# Altium schematic sheet VNA_5.SchDoc: VNA
size 409 x 289 mm; Origin: Eagle; OriginPath: C:\Users\Ground Lab\Desktop\LibreVNA\Hardware\Eagle\VNA.sch; OriginSheet: 6; OriginDescription: Port 1; Date: 04.05.2025 20:03:37; SheetNumber: 6; GateName_1: G$1; SymbolName_1: A3L-LOC; LibraryName: VNA; DeviceSetName: A3L-LOC; Sheet: Sheet:
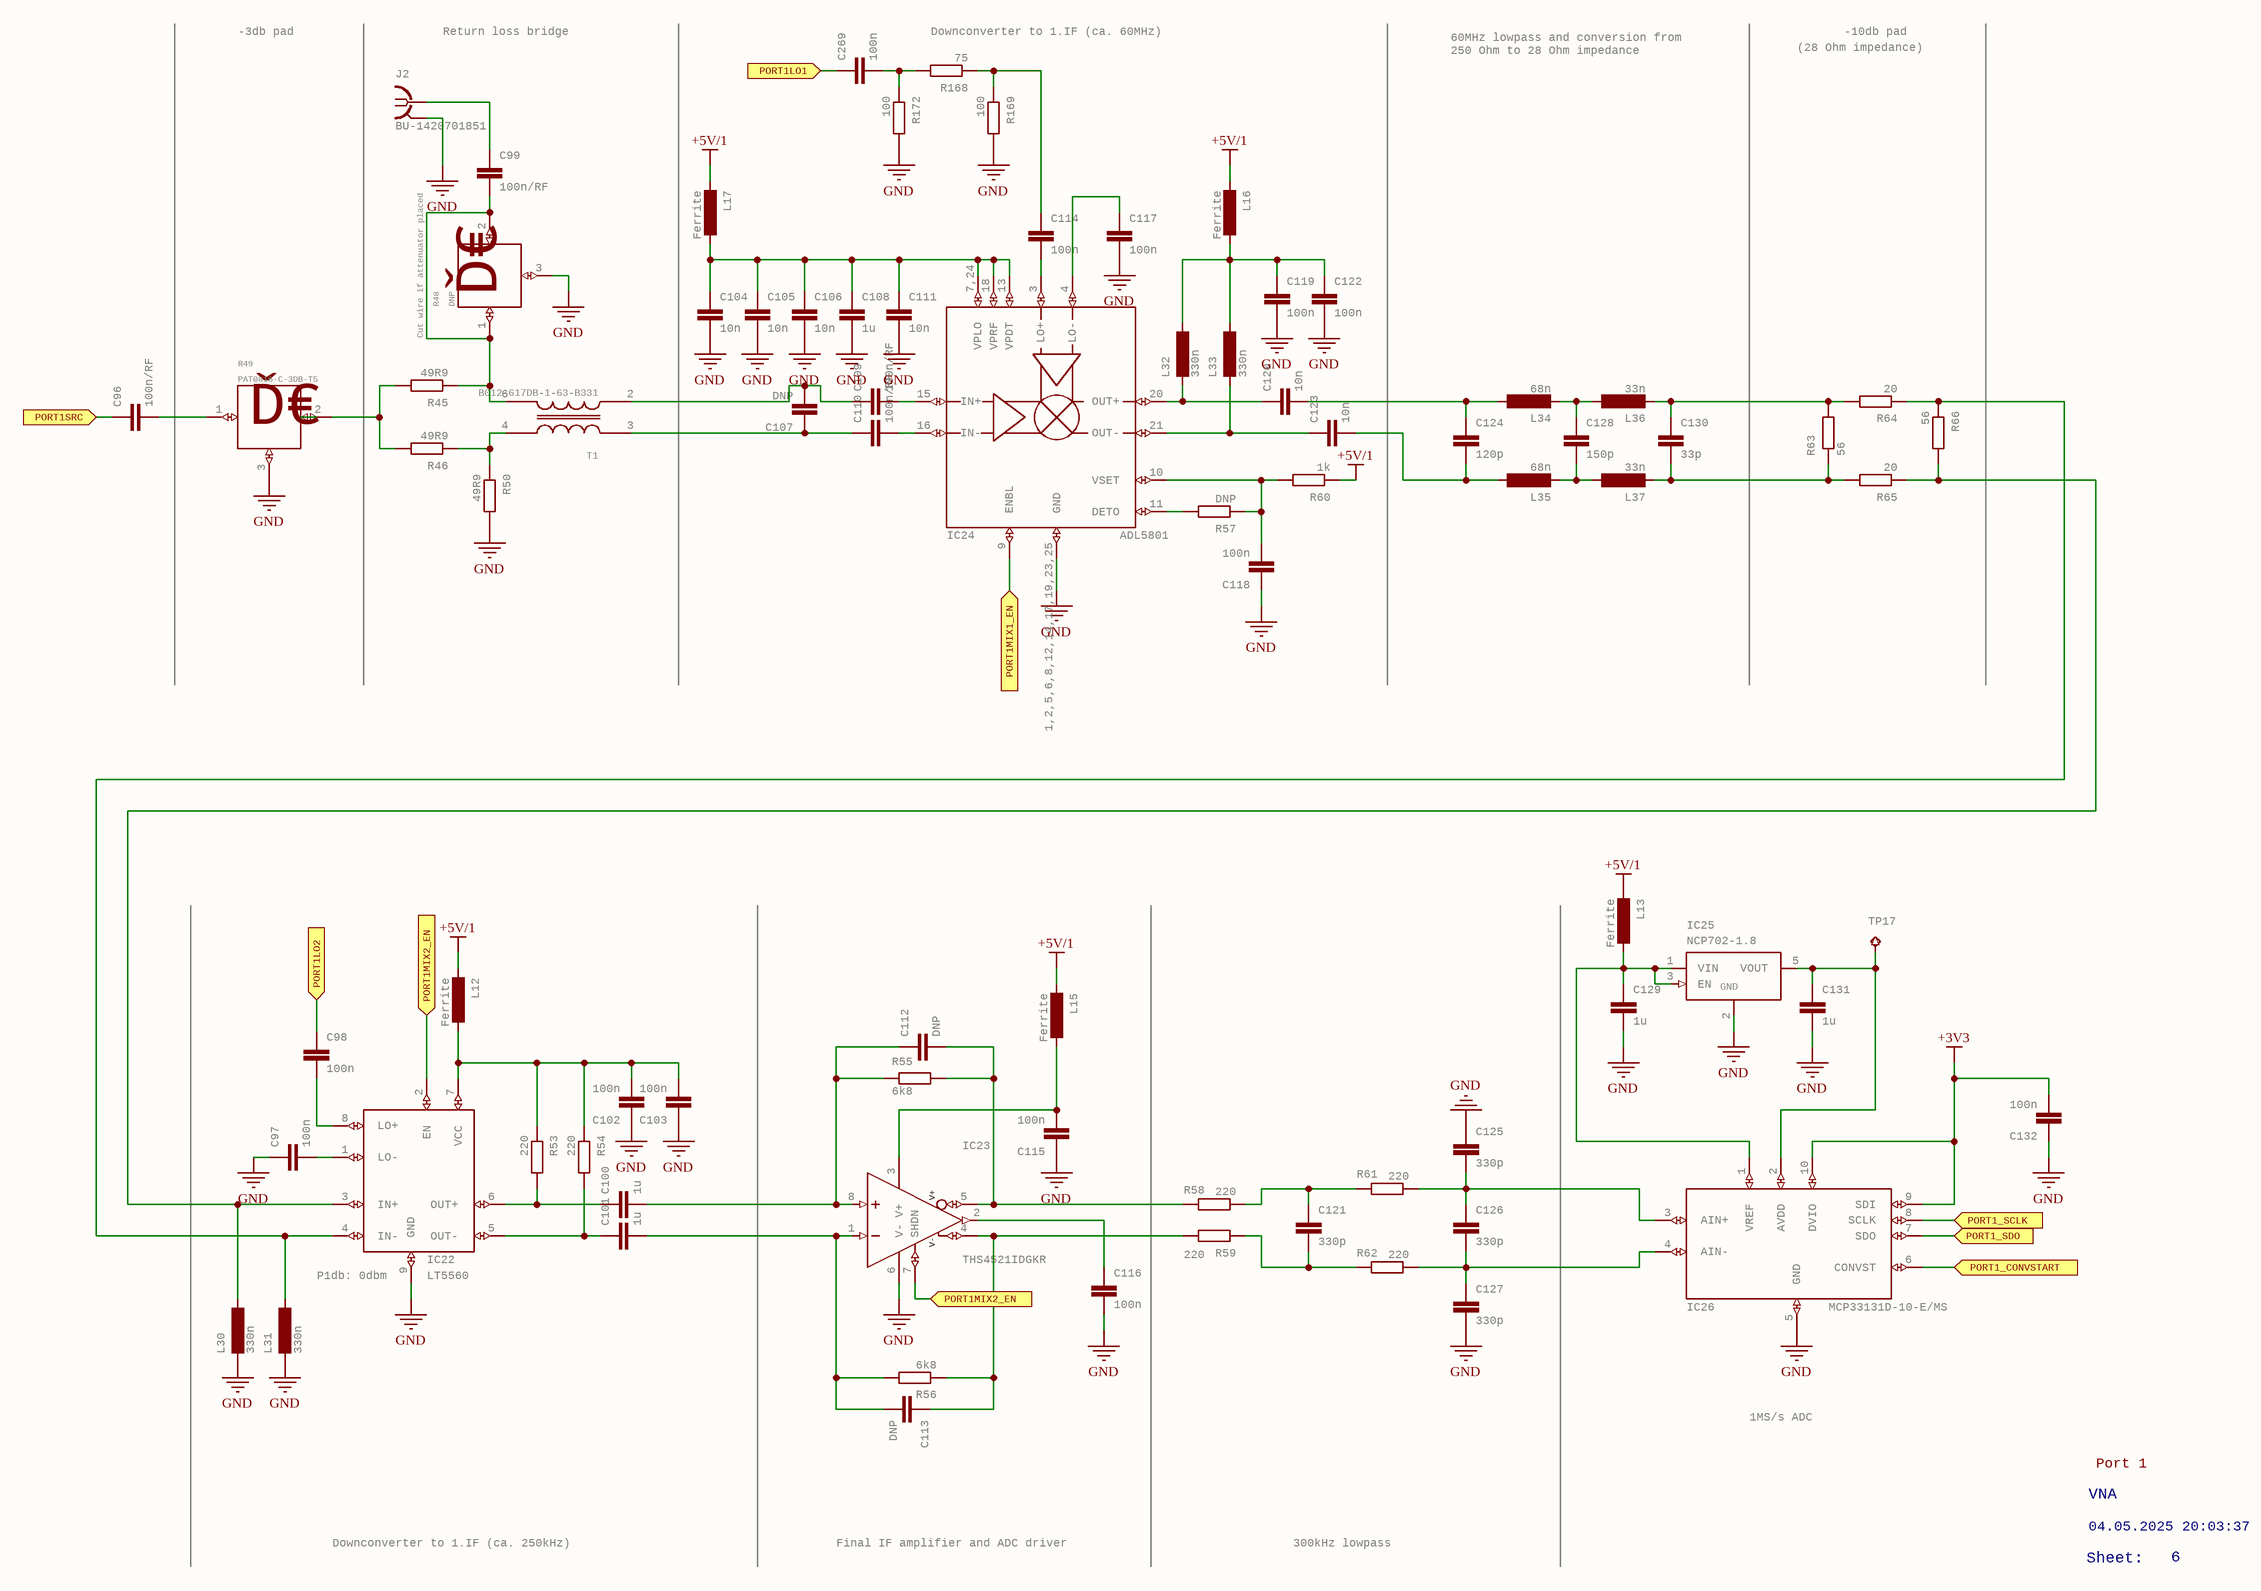
[diagram p0: VNA_5.SchDoc]

## Parts
C96  100n/RF  [C0402]
C97  100n  [C0402]
C98  100n  [C0402]
C99  100n/RF  [C0402]
C100  1u  [C0402]
C101  1u  [C0402]
C102  100n  [C0402]
C103  100n  [C0402]
C104  10n  [C0402]
C105  10n  [C0402]
C106  10n  [C0402]
C107  DNP  [C0402]
C108  1u  [C0402]
C109  100n/RF  [C0402]
C110  100n/RF  [C0402]
C111  10n  [C0402]
C112  DNP  [C0402]
C113  DNP  [C0402]
C114  100n  [C0402]
C115  100n  [C0402]
C116  100n  [C0402]
C117  100n  [C0402]
C118  100n  [C0402]
C119  100n  [C0402]
C120  10n  [C0402]
C121  330p  [C0402]
C122  100n  [C0402]
C123  10n  [C0402]
C124  120p  [C0402]
C125  330p  [C0402]
C126  330p  [C0402]
C127  330p  [C0402]
C128  150p  [C0402]
C129  1u  [C0402]
C130  33p  [C0402]
C131  1u  [C0402]
C132  100n  [C0402]
C269  100n  [C0402]
IC22  LT5560  [SON50P300X300X80-9T165X238]
IC23  THS4521IDGKR  [SOP65P490X110-8N]
IC24  ADL5801  [QFN50P400X400X100-25T250N]
IC25  NCP702-1.8  [SOT95P240X110-5]
IC26  MCP33131D-10-E/MS  [SOP50P490X110-10N]
J2  BU-1420701851  [BU-1420701851]
L12  Ferrite  [R0402]
L13  Ferrite  [R0402]
L15  Ferrite  [R0402]
L16  Ferrite  [R0402]
L17  Ferrite  [R0402]
L30  330n  [L0402]
L31  330n  [L0402]
L32  330n  [L0402]
L33  330n  [L0402]
L34  68n  [L0402]
L35  68n  [L0402]
L36  33n  [L0402]
L37  33n  [L0402]
R45  49R9  [R0402]
R46  49R9  [R0402]
R48  DNP  [PAT0816]
R49  PAT0816-C-3DB-T5  [PAT0816]
R50  49R9  [R0402]
R53  220  [R0402]
R54  220  [R0402]
R55  6k8  [R0402]
R56  6k8  [R0402]
R57  DNP  [R0402]
R58  220  [R0402]
R59  220  [R0402]
R60  1k  [R0402]
R61  220  [R0402]
R62  220  [R0402]
R63  56  [R0402]
R64  20  [R0402]
R65  20  [R0402]
R66  56  [R0402]
R168  75  [R0402]
R169  100  [R0402]
R172  100  [R0402]
T1  B012-617DB-1-63-B331  [EASTEVER_BALUN]
TP17  TPB1,27  [B1,27]  (value not drawn)

## Ports
PORT1_CONVSTART (in), PORT1_SCLK (in), PORT1_SDO (in), PORT1LO1 (in), PORT1LO2 (in), PORT1MIX1_EN (in), PORT1MIX2_EN (in), PORT1SRC (in)

## Nets
+3V3: C132.2 IC26.9(SDI) IC26.10(DVIO)
+5V/1: L12.2 L13.2 L15.2 L16.2 L17.2 R60.1
GND: C97.1 C102.1 C103.1 C104.2 C105.2 C106.2 C108.2 C111.2 C115.1 C116.2 C117.2 C118.1 C119.2 C122.2 C125.1 C127.2 C129.2 C131.2 C132.1 IC22.9(GND) IC23.6(V-) IC24.1,2,5,6,8,12,14,17,19,23,25(GND) IC25.2(GND) IC26.5(GND) J2.G@1-4 L30.2 L31.2 R48.3(GND) R49.3(GND) R50.2 R169.2 R172.2
PORT1_CONVSTART: IC26.6(CONVST) ; port PORT1_CONVSTART
PORT1_SCLK: IC26.8(SCLK) ; port PORT1_SCLK
PORT1_SDO: IC26.7(SDO) ; port PORT1_SDO
PORT1LO1: C269.1 ; port PORT1LO1
PORT1LO2: C98.1 ; port PORT1LO2
PORT1MIX1_EN: IC24.9(ENBL) ; port PORT1MIX1_EN
PORT1MIX2_EN: IC22.2(EN) IC23.7(SHDN) ; port PORT1MIX2_EN
PORT1SRC: C96.1 ; port PORT1SRC
NetC96_2: C96.2 R49.1(IN)
NetC97_2: C97.2 IC22.1(LO-)
NetC98_2: C98.2 IC22.8(LO+)
NetC99_1: C99.1 J2.1
NetC99_2: C99.2 R45.1 R48.1(IN) R48.2(OUT) T1.6(OUT-)
NetC100_1: C100.1 IC22.6(OUT+) R53.2
NetC100_2: C100.2 C112.1 IC23.8(+IN) R55.1
NetC101_1: C101.1 IC22.5(OUT-) R54.2
NetC101_2: C101.2 C113.2 IC23.1(-IN) R56.2
NetC102_2: C102.2 C103.2 IC22.7(VCC) L12.1 R53.1 R54.1
NetC104_1: C104.1 C105.1 C106.1 C108.1 C111.1 IC24.7,24(VPLO) IC24.13(VPDT) IC24.18(VPRF) L17.1
NetC107_1: C107.1 C110.1 T1.3(IN+)
NetC107_2: C107.2 C109.1 T1.2(IN-)
NetC109_2: C109.2 IC24.15(IN+)
NetC110_2: C110.2 IC24.16(IN-)
NetC112_2: C112.2 IC23.5(-OUT) R55.2 R58.2
NetC113_1: C113.1 IC23.4(+OUT) R56.1 R59.2
NetC114_1: C114.1 R168.1 R169.1
NetC114_2: C114.2 IC24.3(LO+)
NetC115_2: C115.2 IC23.3(V+) L15.1
NetC116_1: C116.1 IC23.2(VOCM)
NetC117_1: C117.1 IC24.4(LO-)
NetC118_2: C118.2 IC24.10(VSET) R57.1 R60.2
NetC119_1: C119.1 C122.1 L16.1 L32.1 L33.1
NetC120_1: C120.1 IC24.20(OUT+) L32.2
NetC120_2: C120.2 C124.1 L34.1
NetC121_1: C121.1 R58.1 R61.2
NetC121_2: C121.2 R59.1 R62.2
NetC123_1: C123.1 IC24.21(OUT-) L33.2
NetC123_2: C123.2 C124.2 L35.1
NetC125_2: C125.2 C126.1 IC26.3(AIN+) R61.1
NetC126_2: C126.2 C127.1 IC26.4(AIN-) R62.1
NetC128_1: C128.1 L34.2 L36.1
NetC128_2: C128.2 L35.2 L37.1
NetC129_1: C129.1 IC25.1(VIN) IC25.3(EN) IC26.1(VREF) L13.1
NetC130_1: C130.1 L36.2 R63.2 R64.2
NetC130_2: C130.2 L37.2 R63.1 R65.2
NetC131_1: C131.1 IC25.5(VOUT) IC26.2(AVDD) TP17.TP
NetC269_2: C269.2 R168.2 R172.1
NetIC22_3: IC22.3(IN+) L30.1 R65.1 R66.2
NetIC22_4: IC22.4(IN-) L31.1 R64.1 R66.1
NetIC24_11: IC24.11(DETO) R57.2
NetR45_2: R45.2 R46.2 R49.2(OUT)
NetR46_1: R46.1 R50.1 T1.4(OUT+)

## Notes on the sheet
- -3db pad
- Return loss bridge
- (near R168) Downconverter to 1.IF (ca. 60MHz)
- 60MHz lowpass and conversion from
  250 Ohm to 28 Ohm impedance
- (28 Ohm impedance)
- -10db pad
- Cut wire if attenuator placed
- (near IC22) P1db: 0dbm
- 1MS/s ADC
- VNA
- Port 1
- Downconverter to 1.IF (ca. 250kHz)
- Final IF amplifier and ADC driver
- 300kHz lowpass
- Sheet:
- 04.05.2025 20:03:37
- 6

## Library data of the parts
C96-C132 C269 = C-EU*?:2C0402: CAPACITOR, European symbol; GateName_1: G$1; SymbolName_1: C-EU:1; DeviceName: C0402; LibraryName: VNA; DeviceSetName: C-EU*?:2
IC22 = LT5560: GateName_1: G$1; SymbolName_1: LT5560; LibraryName: VNA; DeviceSetName: LT5560
IC23 = THS4521IDGKR: GateName_1: G$1; SymbolName_1: OPAMPDIFF_SHDN; LibraryName: VNA; DeviceSetName: THS4521IDGKR; V+: V+; V-: V-
IC24 = ADL5801: GateName_1: G$1; SymbolName_1: ADL5801; LibraryName: VNA; DeviceSetName: ADL5801
IC25 = NCP702: GateName_1: G$1; SymbolName_1: VREG_EN; LibraryName: VNA; DeviceSetName: NCP702; GND: GND
IC26 = MCP33131D-10-E/MS: GateName_1: G$1; SymbolName_1: MCP33131D-10-E/MS; LibraryName: VNA; DeviceSetName: MCP33131D-10-E/MS
J2 = BU-1420701851: GateName_1: G$1; SymbolName_1: BNC-FGND; LibraryName: VNA; DeviceSetName: BU-1420701851
L12 L13 L15-L17 = FERRITE: GateName_1: G$1; SymbolName_1: L-EU:1; LibraryName: VNA; DeviceSetName: FERRITE
L30-L37 = INDUCTOR0402: GateName_1: G$1; SymbolName_1: L-EU:1; DeviceName: 0402; LibraryName: VNA; DeviceSetName: INDUCTOR
R45 R46 R50 R53-R66 R168 R169 R172 = R-EU_R0402: RESISTOR, European symbol; GateName_1: G$1; SymbolName_1: R-EU; DeviceSetName: R-EU_; DeviceName: R0402; LibraryName: VNA
R48 R49 = PAT0816-C-3DB-T5: 3dB pad attenuator; GateName_1: G$1; SymbolName_1: ATTENUATOR_3PIN; LibraryName: VNA; DeviceSetName: PAT0816-C-3DB-T5; Ď€: Ď€
T1 = B012-617DB-1-63-B331: GateName_1: G$1; SymbolName_1: BALUN_1:1; LibraryName: VNA; DeviceSetName: B012-617DB-1-63-B331
TP17 = TPB1,27: Test pad; GateName_1: G$1; SymbolName_1: TP; DeviceName: B1,27; LibraryName: VNA; DeviceSetName: TP